# Altium schematic sheet ADXL 343.SchDoc: ADXL343 Wiring
size A; Date: 3/13/2021; Author: Jesse Fernandez; CompanyName: GVSU; DrawnBy: Jesse Fernandez; Organization: Kennedy Hall of Engineering; Address1: 301 Fulton St. W; Address2: Grand Rapids, MI 49504; DocumentNumber: 1; Revision: 0.1; SheetNumber: 3; SheetTotal: 7; Time: 5:42 am
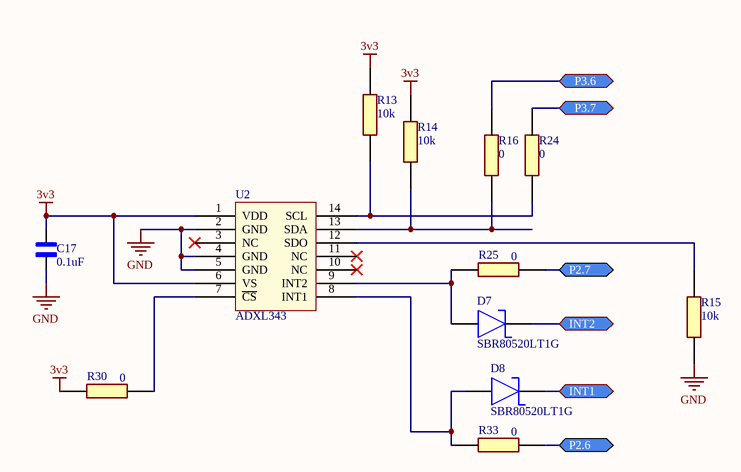
[diagram p0: ADXL 343.SchDoc]

## Parts
C17  value 0.1uF  [CAPC1005X55N]  (hidden comment: Multilayer Ceramic Cap. 0402 (1005 Metric))
D7  SBR80520LT1G  [Diode SOD-123-2]
D8  SBR80520LT1G  [Diode SOD-123-2]
R13  value 10k  [Thin-Film Resistor 0402 (1005 Metric)]  (hidden comment: Resistor 0402 (1005 Metric))
R14  value 10k  [Thin-Film Resistor 0402 (1005 Metric)]  (hidden comment: Resistor 0402 (1005 Metric))
R15  value 10k  [Thin-Film Resistor 0402 (1005 Metric)]  (hidden comment: Resistor 0402 (1005 Metric))
R16  value 0  [Resistor 0603]  (hidden comment: Resistor 0603)
R24  value 0  [Resistor 0603]  (hidden comment: Resistor 0603)
R25  value 0  [Resistor 0603]  (hidden comment: Resistor 0603)
R30  value 0  [Resistor 0603]  (hidden comment: Resistor 0603)
R33  value 0  [Resistor 0603]  (hidden comment: Resistor 0603)
U2  ADXL343  [ADXL343]

## Ports
INT1 (bidir), INT2 (bidir), P2.6 (bidir), P2.7 (bidir), P3.6 (bidir), P3.7 (bidir)

## Nets
3v3: C17.2 R13.2 R14.2 R30.2 U2.1(VDD) U2.6(VS)
GND: C17.1 R15.1 U2.2(GND) U2.4(GND) U2.5(GND)
INT1: D8.1(K) ; port INT1
INT2: D7.1(K) ; port INT2
P2.6: R33.1 ; port P2.6
P2.7: R25.1 ; port P2.7
P3.6: R16.2 ; port P3.6
P3.7: R24.2 ; port P3.7
NetD7_2: D7.2(A) R25.2 U2.9(INT2)
NetD8_2: D8.2(A) R33.2 U2.8(INT1)
NetR13_1: R13.1 R24.1 U2.14(SCL)
NetR14_1: R14.1 R16.1 U2.13(SDA)
NetR15_2: R15.2 U2.12(SDO)
NetR30_1: R30.1 U2.7(~{CS})

Not connected (* = marked no-connect by the designer): U2 3(NC)* 10(NC)* 11(NC)*

## Notes on the sheet
- Title
- Size:
- Date:
- A
- Number:
- Time:
- Revision:
- Sheet
- of
- Engineer:
- File:

## Library data of the parts
C17 = Multilayer Ceramic Cap. 0402 (1005 Metric): Capacitor X6S 0402 (1005 Metric); Manufacturer: Murata Electronics; Manufacturer P/N: GRM155R71H104KE14D; Vendor: Mouser; Vendor P/N: 81-GRM155R71H104KE4D; Tolerance: 10%; Price: $0.10; ComponentLink1Description: Datasheet; ComponentLink1URL: *
D7 D8 = SBR80520LT1G: Schottky Diodes & Rectifiers REC SPCL SKTKY; Manufacturer: ON Semiconductor; Vendor: Mouser; Vendor P/N: 863-SBR80520LT1G; Manufacturer P/N: SBR80520LT1G; Price: $0.43; ComponentLink1Description: Datasheet; ComponentLink1URL: https://www.mouser.com/datasheet/2/308/MBR0520LT1_D-1810808.pdf
R13-R15 = Resistor 0402 (1005 Metric): Resistor, 0402 Package size; Manufacturer: Vishay / Dale; Manfacturer P/N: RCS040210K0FKED; Vendor: Mouser; Vendor P/N: 71-RCS040210K0FKED; Tolerance: 1%; Price: $0.12; ComponentLink1Description: Datasheet; ComponentLink1URL: *
R16 R24 R25 R30 R33 = Resistor 0603: Tolerance: *tolerance*; Manufacturer: *; Manufacturer P/N: *; Vendor: *; Vendor P/N: *; Price: *
U2 = ADXL343: Accelerometer X, Y, Z Axis ±2g, 4g, 8g, 16g 0.05Hz ~ 1.6kHz 14-LGA (3x5); Manufacturer: Analog Devices Inc.; Manufactuer P/N: ADXL343BCCZ-RL7; Vendor: Digikey Corps.; Vendor P/N: ADXL343BCCZ-RL7TR-ND; Price: $3.10; ComponentLink1Description: Datasheet; ComponentLink1URL: https://www.analog.com/media/en/technical-documentation/data-sheets/ADXL343.pdf; ComponentLink2Description: Breakout Board Schematics; ComponentLink2URL: https://cdn-learn.adafruit.com/downloads/pdf/adxl343-breakout-learning-guide.pdf